# EAGLE design netflix-switch (EAGLE 7.6.0)
AUTHOR: Tomas Basham; REV: 1
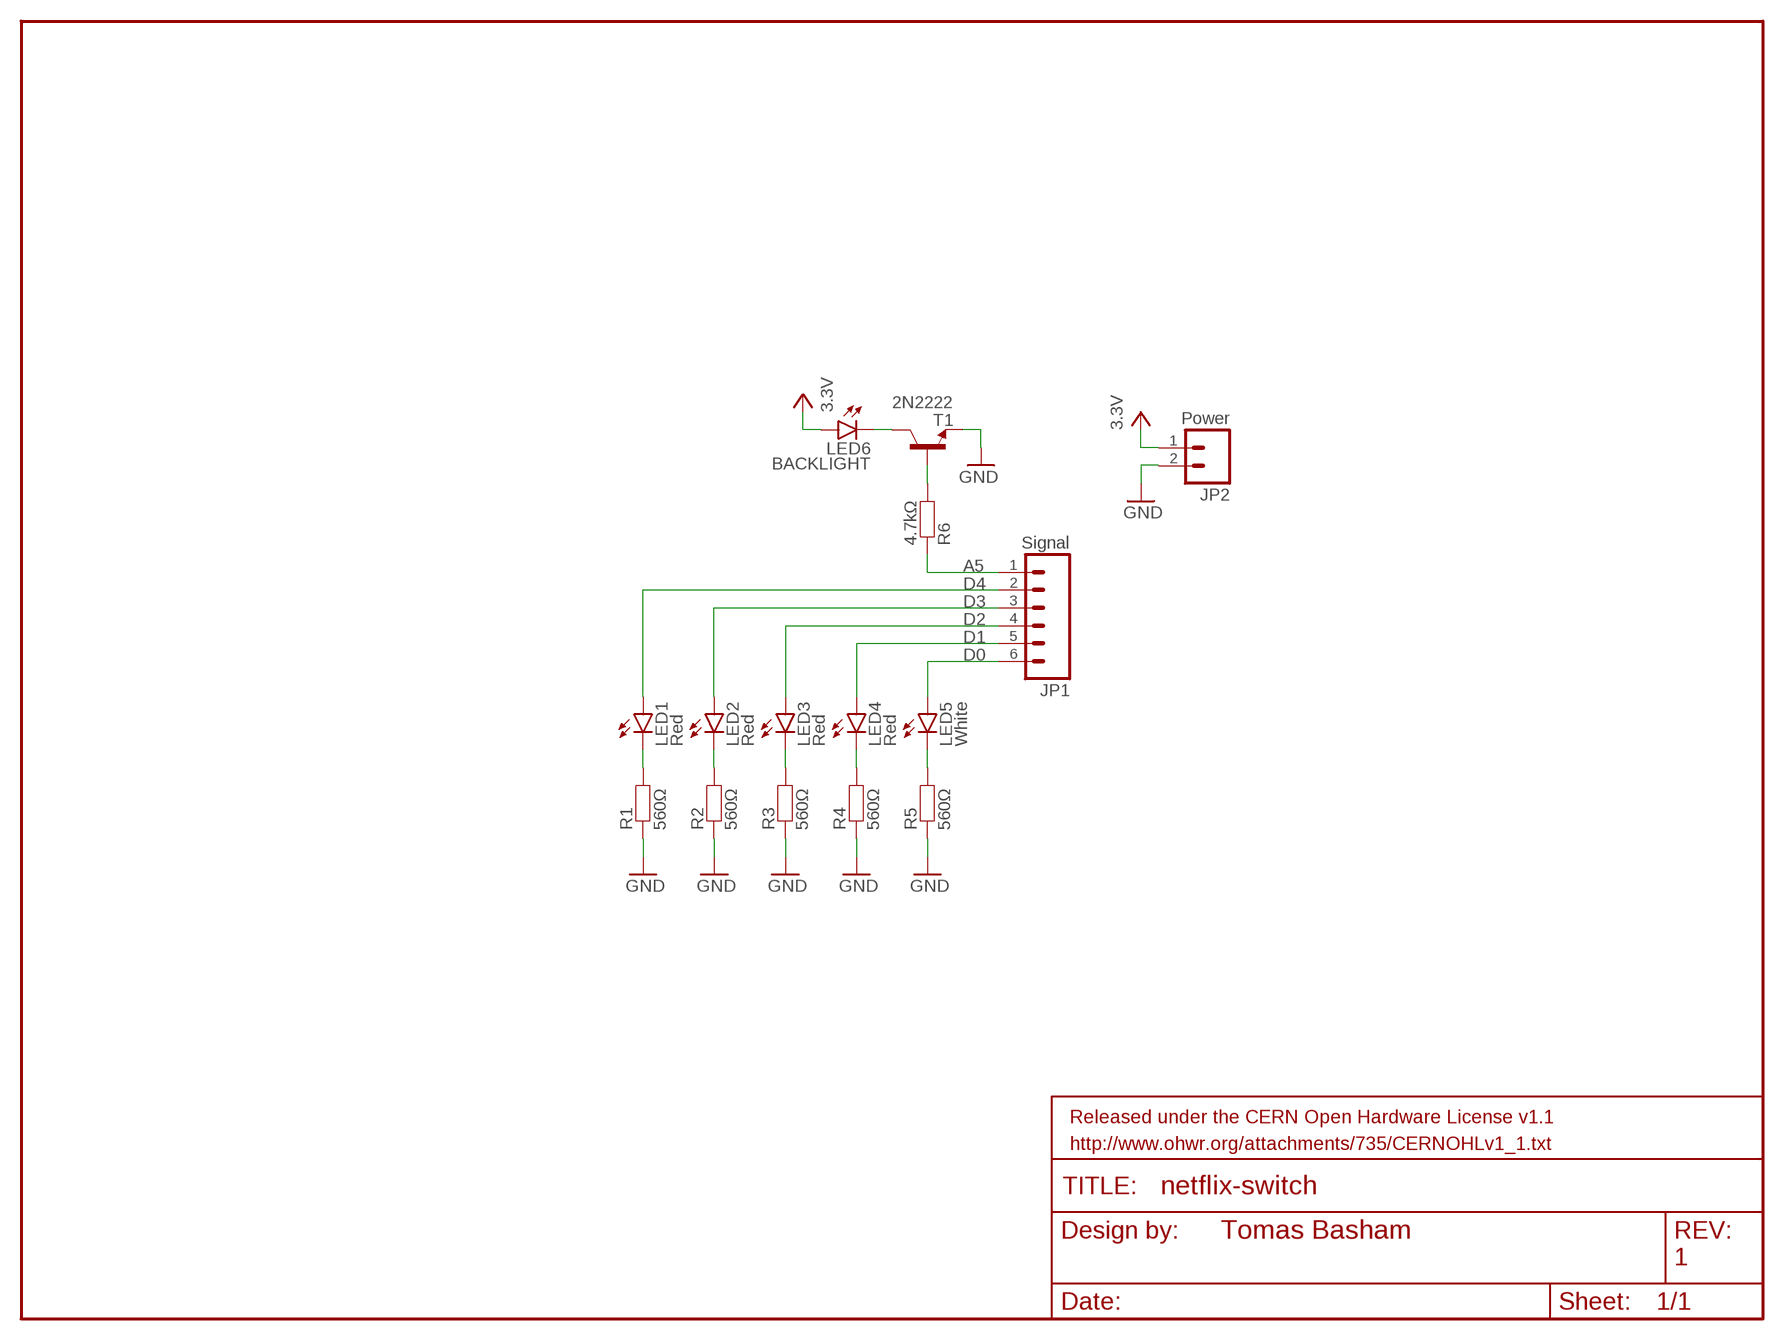
[diagram p0: schematic, sheet 1]

## Parts
FRAME1  FRAME-LETTER  [CREATIVE_COMMONS]
JP1  Signal  M06SIP  [1X06]
JP2  Power  M02PTH  [1X02]
LED1  Red  LED-3MM-NO_SILK  [LED3MM-NS]
LED2  Red  LED-3MM-NO_SILK  [LED3MM-NS]
LED3  Red  LED-3MM-NO_SILK  [LED3MM-NS]
LED4  Red  LED-3MM-NO_SILK  [LED3MM-NS]
LED5  White  LED-3MM-NO_SILK  [LED3MM-NS]
LED6  BACKLIGHT  LED-5MM-NO_SILK  [LED5MM-NS]
R1  560Ω  RESISTOR0603  [0603]
R2  560Ω  RESISTOR0603  [0603]
R3  560Ω  RESISTOR0603  [0603]
R4  560Ω  RESISTOR0603  [0603]
R5  560Ω  RESISTOR0603  [0603]
R6  4.7kΩ  RESISTOR0603  [0603]
T1  2N2222  [TO92-EBC-OVAL]

## Nets
A5: JP1.1 R6.1
D0: JP1.6 LED5.A
D1: JP1.5 LED4.A
D2: JP1.4 LED3.A
D3: JP1.3 LED2.A
D4: JP1.2 LED1.A
GND: JP2.2 R1.1 R2.1 R3.1 R4.1 R5.1 T1.E
N$1: LED1.K(C) R1.2
N$2: LED2.K(C) R2.2
N$3: LED3.K(C) R3.2
N$4: LED4.K(C) R4.2
N$5: LED5.K(C) R5.2
N$8: R6.2 T1.B
N$15: LED6.K(C) T1.C
VCC: JP2.1 LED6.A ; supply symbol labelled 3.3V

## Library data of the parts
FRAME1 = falcon:FRAME-LETTER: Schematic Frame Standard 8.5x11 US Letter frame; OC_FARNELL: unknown
JP1 = freetronics-master-v1.1:M06: Header 6 Standard 6-pin 0.1" header. Use with straight break away headers (SKU : PRT-00116), right angle break away headers (PRT-00553), swiss pins (PRT-00743), machine pins (PRT-00117), and female headers (PRT-00115). Molex polarized connector foot print use with SKU : PRT-08094 with associated crimp pins and housings. NOTES ON THE VARIANTS LOCK and LOCK_LONGPADS... This footprint was designed to help hold the alignment of a through-hole component (i.e. 6-pin header) while soldering it into place. You may notice that each hole has been shifted either up or down by 0.005 of an inch from it's more standard position (which is a perfectly straight line). This slight alteration caused the pins (the squares in the middle) to touch the edges of the holes. Because they are alternating, it causes a "brace" to hold the component in place. 0.005 has proven to be the perfect amount of "off-center" position when using our standard breakaway headers. Although looks a little odd when you look at the bare footprint, once you have a header in there, the alteration is very hard to notice. Also, if you push a header all the way into place, it is covered up entirely on the bottom side. This idea of altering the position of holes to aid alignment will be further integrated into the Sparkfun Library for other footprints. It can help hold any component with 3 or more connection pins.; OC_FARNELL: unknown
JP2 = freetronics-master-v1.1:M02: Header 2 Standard 2-pin 0.1" header. Use with straight break away headers (SKU : PRT-00116), right angle break away headers (PRT-00553), swiss pins (PRT-00743), machine pins (PRT-00117), and female headers (PRT-00115). Molex polarized connector foot print use with SKU : PRT-08233 with associated crimp pins and housings.; OC_FARNELL: unknown
LED1-LED4 = falcon:LED: LEDs Standard schematic elements and footprints for 5mm, 3mm, 1206, and 0603 sized LEDs. 5mm - Spark Fun Electronics SKU : COM-00529 (and others); MF: KINGBRIGHT; MPN: L-934ID-5V; OC_FARNELL: 2217957
LED5 = falcon:LED: LEDs Standard schematic elements and footprints for 5mm, 3mm, 1206, and 0603 sized LEDs. 5mm - Spark Fun Electronics SKU : COM-00529 (and others); MF: VISHAY; MPN: VLHW4100; OC_FARNELL: 2419077
LED6 = falcon:LED: LEDs Standard schematic elements and footprints for 5mm, 3mm, 1206, and 0603 sized LEDs. 5mm - Spark Fun Electronics SKU : COM-00529 (and others); OC_FARNELL: unknown
R1-R5 = freetronics-master-v1.1:RESISTOR: Resistor Basic schematic elements and footprints for 0603, 1206, and PTH 1/10th watt (small) resistors.; MF: VISHAY; MPN: CRCW0603560RFKEA; OC_FARNELL: 1469828
R6 = freetronics-master-v1.1:RESISTOR: Resistor Basic schematic elements and footprints for 0603, 1206, and PTH 1/10th watt (small) resistors.; MF: VISHAY; MPN: CRCW06034K70FKEA; OC_FARNELL: 1469807
T1 = adafruit:2N2222: NPN TRANSISTOR Big oval pads; MF: ON SEMICONDUCTOR; MPN: P2N2222AG; OC_FARNELL: 1611371

## Board
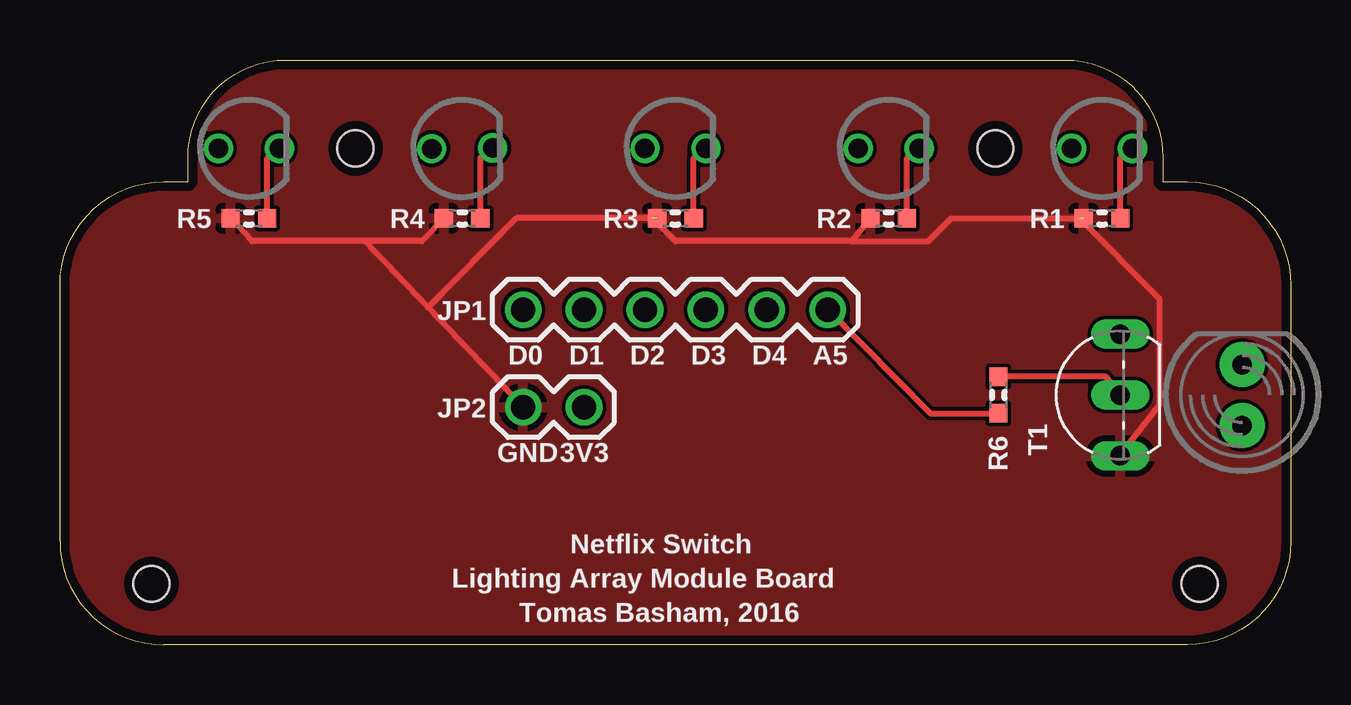
[diagram p1: board, top side]
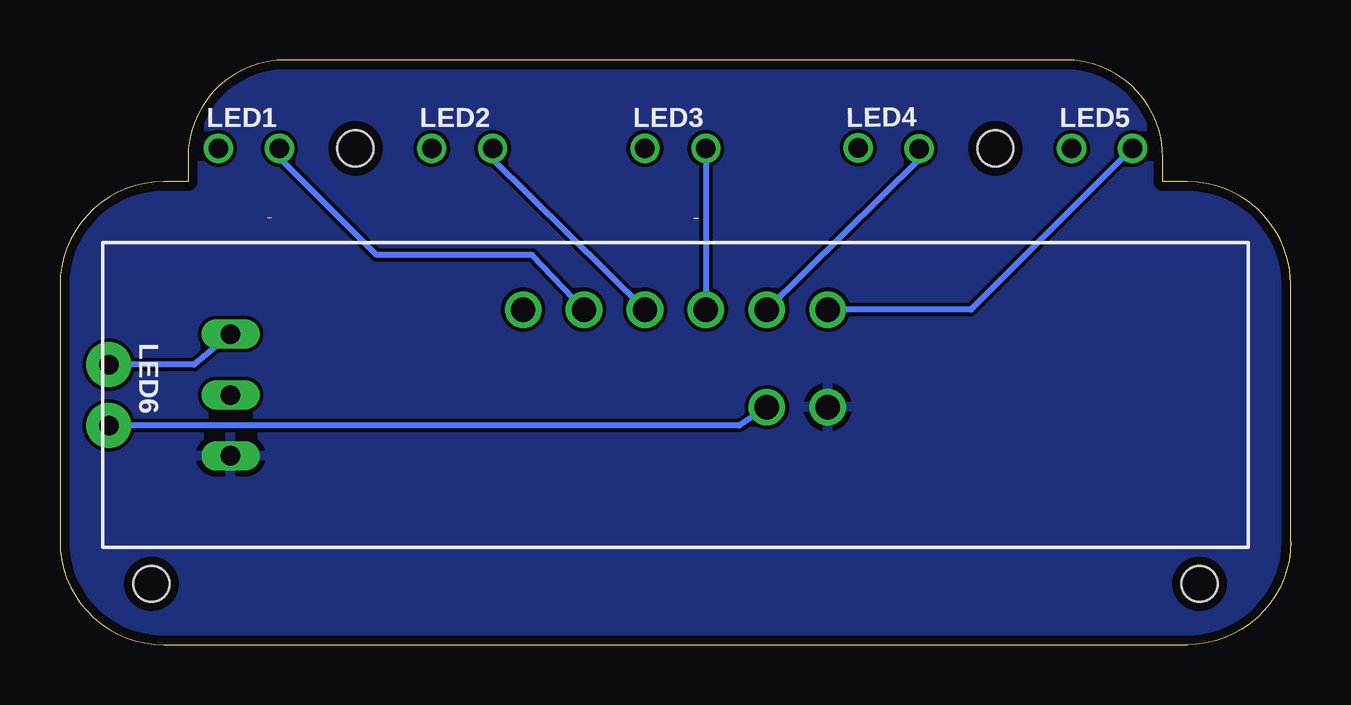
[diagram p2: board, bottom side, seen from below]

Size 51.31 x 24.38 mm. Coordinates in mm from the lower left corner, seen from the top.
Outline: 0,4.32 0,14.99 arc-90 4.32,19.3 5.33,19.3 5.33,20.32 arc-90 9.4,24.38 41.91,24.38 arc-90 45.97,20.32 45.97,19.3 46.99,19.3 arc-90 51.31,14.99 51.31,4.32 arc-90 46.99,0 4.32,0 arc-90 0,4.32
Copper layers (1*16): Top 0.0356mm / dielectric 1.5011mm / Bottom 0.0356mm
Design rules "LaenPCBOrder": minimum track width 6mil, minimum drill 13mil, track to track 6mil, track to pad 6mil, pad to pad 6mil, via to via 6mil, smd to smd 6mil, copper to edge 15mil, drill to drill 6mil, minimum pad ring 7mil, minimum via ring 7mil, stop-mask expansion 3mil, vias tented up to drill 0mil, thermal gap 10mil
Holes 1.5 mm at 3.81,2.54 47.5,2.54 12.32,20.7 38.99,20.7

### Footprints (pad centres in the part's own frame; a part is rotated, then mirrored left to right if it is on the bottom)
1X06 = drill 1.016: 1 0,0; 2 2.54,0; 3 5.08,0; 4 7.62,0; 5 10.16,0; 6 12.7,0
1X02 = drill 1.016: 1 0,0; 2 2.54,0
LED3MM-NS = drill 0.813: A -1.27,0; K 1.27,0
LED5MM-NS = drill 0.813 pad 1.88: A -1.27,0; K 1.27,0
0603 = smd 0.762 x 0.762: 1 -0.762,0; 2 0.762,0
TO92-EBC-OVAL = drill 0.813 long: B 0,-1.27; C 2.54,-1.27; E -2.54,-1.27

### Placement (x,y rotation side)
FRAME1  -13.97,-7.62 0 top  (outside the outline)
JP1  32,13.97 180 top
JP2  21.84,9.91 180 top
LED1  43.43,20.7 0 top
LED2  34.54,20.7 0 top
LED3  25.65,20.7 0 top
LED4  16.76,20.7 0.7 top
LED5  7.87,20.7 0 top
LED6  49.28,10.41 90 top
R1  43.43,17.78 0 top
R2  34.54,17.78 0 top
R3  25.65,17.78 0 top
R4  16.76,17.78 0 top
R5  7.87,17.78 0 top
R6  39.12,10.41 90 top
T1  42.93,10.41 90 top

### Tracks (layer width: path | path; a pad name or v marks a point on that pad's centre or on a via)
A5
  Top 0.254: 39.37,9.68 R6.1 36.28,9.65 JP1.1
D0
  Bottom 0.254: LED5.A 13.34,13.97 JP1.6
D1
  Bottom 0.254: LED4.A 15.49,20.26 JP1.5
D2
  Bottom 0.254: LED3.A JP1.4
D3
  Bottom 0.254: LED2.A 33.27,20.26 JP1.3
D4
  Bottom 0.254: LED1.A 42.16,20.32 38.1,16.26 31.62,16.26 JP1.2
GND  (2 unrouted)
  Top 0.254: 12.7,16.83 15.08,16.83 R4.1 | 12.7,16.83 8,16.83 R5.1 | 33.02,16.83 25.65,16.83 24.7,17.78 19.02,17.78 15.34,14.06 | 33.02,16.83 36.2,16.83 37.15,17.78 42.48,17.78 45.81,14.45 45.81,10 44.45,8.26 T1.E | 33.02,16.83 R2.1 | JP2.2 15.34,14.06 | 15.34,14.06 12.7,16.83
  pour Top: -1.27,-1.27 -1.27,25.91 52.58,25.91 52.58,-1.27
  pour Bottom: -1.27,-1.27 -1.27,25.91 52.58,25.91 52.58,-1.27
N$1
  Top 0.254: R1.2 44.2,20.28 LED1.K
N$2
  Top 0.254: R2.2 35.31,20.28 LED2.K
N$3
  Top 0.254: R3.2 26.42,20.28 LED3.K
N$4
  Top 0.254: R4.2 17.53,20.3 LED4.K
N$5
  Top 0.254: R5.2 8.64,20.28 LED5.K
N$8
  Top 0.254: 39.37,11.11 R6.2 43.6,11.18 T1.B
N$15
  Bottom 0.254: T1.C 45.72,11.68 LED6.K
VCC
  Bottom 0.254: JP2.1 22.99,9.14 LED6.A

### Text on the board
tPlace: D0 | D1 | D2 | D3 | D4 | A5 | GND | 3V3 | Netflix Switch | Lighting Array Module Board | Tomas Basham, 2016